# EAGLE design London_EPS-v.2.0 (EAGLE 9.4.2)
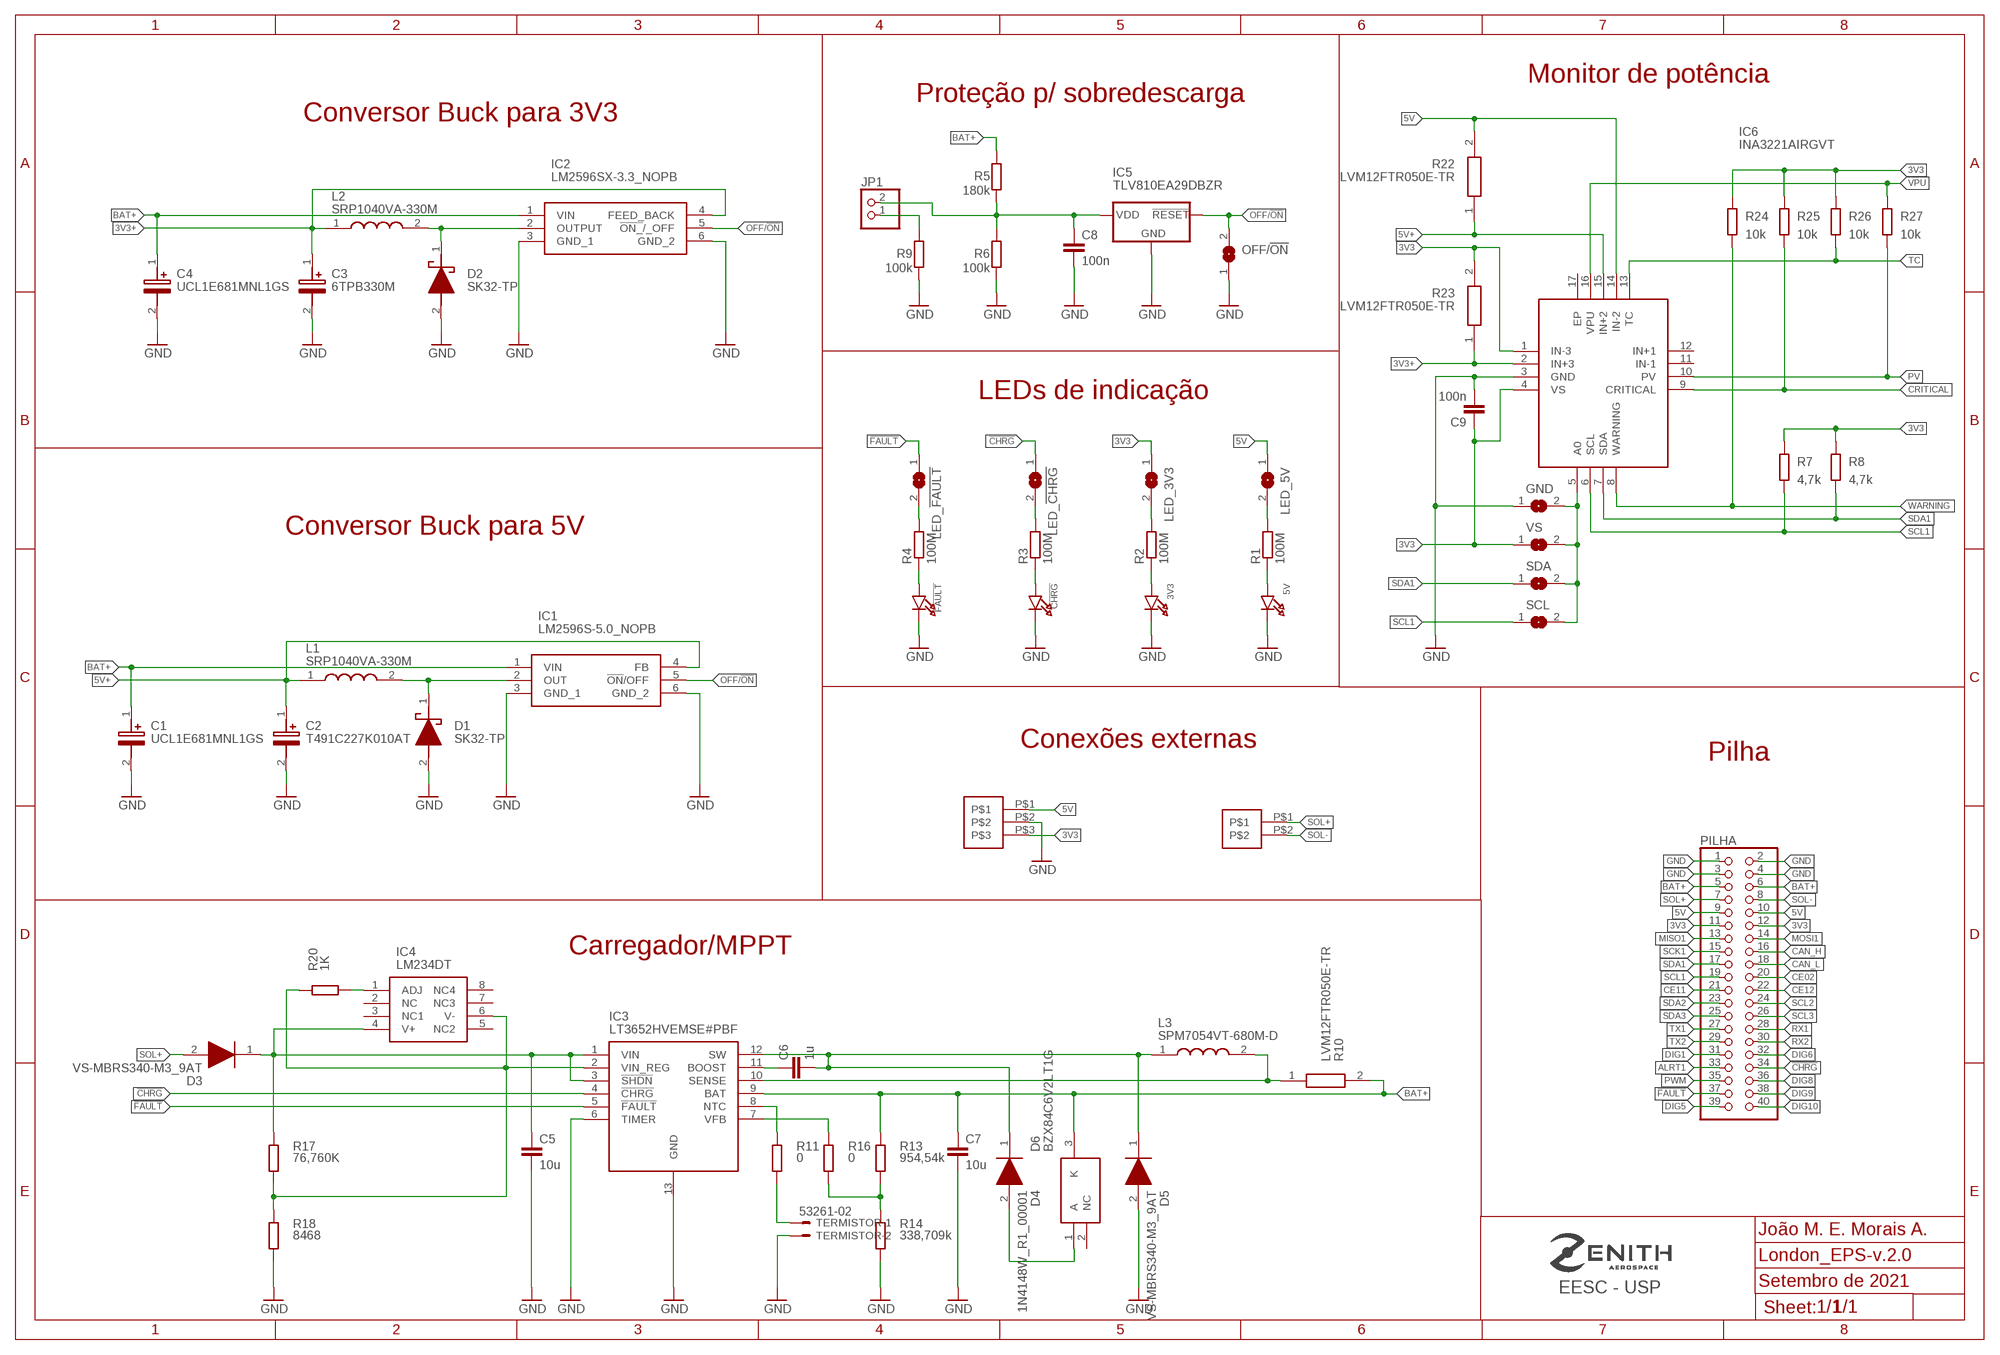
[diagram p0: schematic, sheet 1]

## Parts
3V3  LED1206  [CHIPLED_1206]
5V  LED1206  [CHIPLED_1206]
!CHRG  LED1206  [CHIPLED_1206]
!FAULT  LED1206  [CHIPLED_1206]
C1  UCL1E681MNL1GS  [CAPAE1030X1400N]
C2  T491C227K010AT  [CAPPM6032X280N]
C3  6TPB330M  [10TPF150ML]
C4  UCL1E681MNL1GS  [CAPAE1030X1400N]
C5  10u  C-EUC0805  [C0805]
C6  1u  C-EUC0805  [C0805]
C7  10u  C-EUC0805  [C0805]
C8  100n  C-EUC0805  [C0805]
C9  100n  C-EUC0805  [C0805]
D1  SK32-TP  [DIOM7959X262N@1]
D2  SK32-TP  [DIOM7959X262N@1]
D3  VS-MBRS340-M3_9AT  [DIOM7959X262N]
D4  1N4148W_R1_00001  [SOD3816X135N]
D5  VS-MBRS340-M3_9AT  [DIOM7959X262N]
D6  BZX84C6V2LT1G  [SOT96P237X111-3N]
GND  SOLDERJUMPERREFLOW_NOPASTE  [SOLDERJUMPER_REFLOW_NOPASTE]
IC1  LM2596S-5.0_NOPB  [KTT0005B]
IC2  LM2596SX-3.3_NOPB  [KTT0005B]
IC3  LT3652HVEMSE#PBF  [SOP65P490X110-13N]
IC4  LM234DT  [SOIC127P600X175-8N]
IC5  TLV810EA29DBZR  [SOT23]
IC6  INA3221AIRGVT  [QFN65P400X400X100-17N]
JP1  PINHD-1X2/90  [1X02/90]
L1  SRP1040VA-330M  [INDPM110100X400N]
L2  SRP1040VA-330M  [INDPM110100X400N]
L3  SPM7054VT-680M-D  [SPM7054VT]
LED_3V3  SOLDERJUMPERREFLOW_NOPASTE  [SOLDERJUMPER_REFLOW_NOPASTE]
LED_5V  SOLDERJUMPERREFLOW_NOPASTE  [SOLDERJUMPER_REFLOW_NOPASTE]
LED_!CHRG  SOLDERJUMPERREFLOW_NOPASTE  [SOLDERJUMPER_REFLOW_NOPASTE]
LED_!FAULT  SOLDERJUMPERREFLOW_NOPASTE  [SOLDERJUMPER_REFLOW_NOPASTE]
OFF/!ON  SOLDERJUMPERREFLOW_NOPASTE  [SOLDERJUMPER_REFLOW_NOPASTE]
PILHA  PINHD-2X20  [2X20]
R1  100M  R-EU_R0805  [R0805]
R2  100M  R-EU_R0805  [R0805]
R3  100M  R-EU_R0805  [R0805]
R4  100M  R-EU_R0805  [R0805]
R5  180k  R-EU_R0805  [R0805]
R6  100k  R-EU_R0805  [R0805]
R7  4,7k  R-EU_R0805  [R0805]
R8  4,7k  R-EU_R0805  [R0805]
R9  100k  R-EU_R0805  [R0805]
R10  LVM12FTR050E-TR  [RESC3016X70N]
R11  0  R-EU_R0805  [R0805]
R13  954,54k  R-EU_R0805  [R0805]
R14  338,709k  R-EU_R0805  [R0805]
R16  0  R-EU_R0805  [R0805]
R17  76,760K  R-EU_R0805  [R0805]
R18  8468  R-EU_R0805  [R0805]
R20  1K  R-EU_R0805  [R0805]
R22  LVM12FTR050E-TR  [RESC3016X70N]
R23  LVM12FTR050E-TR  [RESC3016X70N]
R24  10k  R-EU_R0805  [R0805]
R25  10k  R-EU_R0805  [R0805]
R26  10k  R-EU_R0805  [R0805]
R27  10k  R-EU_R0805  [R0805]
SCL  SOLDERJUMPERREFLOW_NOPASTE  [SOLDERJUMPER_REFLOW_NOPASTE]
SDA  SOLDERJUMPERREFLOW_NOPASTE  [SOLDERJUMPER_REFLOW_NOPASTE]
TERMISTOR  53261-02  [53261-02]
U$1  S02B-XASS-1  [S02B-XASS-1]
U$2  S03B-XASS-1  [S03B-XASS-1]
VS  SOLDERJUMPERREFLOW_NOPASTE  [SOLDERJUMPER_REFLOW_NOPASTE]

## Nets
3V3: C9.1 IC6.1(IN-3) IC6.4(VS) LED_3V3.1 PILHA.11 PILHA.12 R7.2 R8.2 R23.2 R24.2 R25.2 R26.2 U$2.P$3 VS.1
3V3+: C3.1(+) IC2.4(FEED_BACK) IC6.2(IN+3) L2.1 R23.1
5V: IC6.14(IN-2) LED_5V.1 PILHA.9 PILHA.10 R22.2 U$2.P$1
5V+: C2.1(+) IC1.4(FB) IC6.15(IN+2) L1.1 R22.1
!CHRG: IC3.4(!CHRG) LED_!CHRG.1 PILHA.34
!FAULT: IC3.5(!FAULT) LED_!FAULT.1 PILHA.37
ALRT1: PILHA.33
BAT+: C1.1(+) C4.1(+) C7.1 D6.3(K) IC1.1(VIN) IC2.1(VIN) IC3.9(BAT) PILHA.5 PILHA.6 R5.1 R10.2 R13.1
CAN_H: PILHA.16
CAN_L: PILHA.18
CE02: PILHA.20
CE11: PILHA.21
CE12: PILHA.22
CRITICAL: IC6.9(CRITICAL) R25.1
DIG1: PILHA.31
DIG5: PILHA.39
DIG6: PILHA.32
DIG8: PILHA.36
DIG9: PILHA.38
DIG10: PILHA.40
GND: 3V3.C 5V.C !CHRG.C !FAULT.C C1.2(-) C2.2(-) C3.2(-) C4.2(-) C5.2 C7.2 C8.2 C9.2 D1.2(A) D2.2(A) D5.2(A) GND.1 IC1.3(GND_1) IC1.6(GND_2) IC2.3(GND_1) IC2.6(GND_2) IC3.6(TIMER) IC3.13(GND) IC5.2(GND) IC6.3(GND) OFF/!ON.1 PILHA.1 PILHA.2 PILHA.3 PILHA.4 R6.2 R9.2 R14.2 R18.2 TERMISTOR.2 U$2.P$2
MISO1: PILHA.13
MOSI1: PILHA.14
N$1: 5V.A R1.1
N$2: LED_5V.2 R1.2
N$3: 3V3.A R2.1
N$4: LED_3V3.2 R2.2
N$5: !CHRG.A R3.1
N$6: D2.1(K) IC2.2(OUTPUT) L2.2
N$7: LED_!CHRG.2 R3.2
N$8: D1.1(K) IC1.2(OUT) L1.2
N$9: !FAULT.A R4.1
N$10: LED_!FAULT.2 R4.2
N$11: C8.1 IC5.3(VDD) JP1.2 R5.2 R6.1
N$12: GND.2 IC6.5(A0) SCL.2 SDA.2 VS.2
N$13: JP1.1 R9.1
N$20: IC3.10(SENSE) L3.2 R10.1
N$21: IC3.8(NTC) R11.1
N$22: R11.2 TERMISTOR.1
N$23: C6.2 D4.1(K) D5.1(K) IC3.12(SW) L3.1
N$24: IC3.7(VFB) R16.1
N$25: R13.2 R14.1 R16.2
N$26: C6.1 IC3.11(BOOST)
N$27: C5.1 D3.1(K) IC3.1(VIN) IC3.3(!SHDN) IC4.4(V+) R17.1
N$28: IC3.2(VIN_REG) IC4.6(V-) R17.2 R18.1 R20.1
N$29: IC4.1(ADJ) R20.2
N$30: D4.2(A) D6.1(A)
OFF/!ON: IC1.5(!ON!/OFF) IC2.5(!ON_!/_OFF) IC5.1(!RESET) OFF/!ON.2
PV: IC6.10(PV) R27.1
PWM: PILHA.35
RX1: PILHA.28
RX2: PILHA.30
SCK1: PILHA.15
SCL1: IC6.6(SCL) PILHA.19 R7.1 SCL.1
SCL2: PILHA.24
SCL3: PILHA.26
SDA1: IC6.7(SDA) PILHA.17 R8.1 SDA.1
SDA2: PILHA.23
SDA3: PILHA.25
SOL+: D3.2(A) PILHA.7 U$1.P$1
SOL-: PILHA.8 U$1.P$2
TC: IC6.13(TC) R26.1
TX1: PILHA.27
TX2: PILHA.29
VPU: IC6.16(VPU) R27.2
WARNING: IC6.8(WARNING) R24.1
Unconnected: D6.2(NC) IC4.2(NC) IC4.3(NC1) IC4.5(NC2) IC4.7(NC3) IC4.8(NC4) IC6.11(IN-1) IC6.12(IN+1) IC6.17(EP)

## Notes on the sheet
- Monitor de potência
- Proteção p/ sobredescarga
- Conversor Buck para 3V3
- LEDs de indicação
- Conversor Buck para 5V
- Conexões externas
- Pilha
- Carregador/MPPT
- João M. E. Morais A.
- EESC - USP | Setembro de 2021
- 1/1
- C:/Users/marcu/Desktop/Ensino Superior/Graduação - Eng Elétrica/Zenith/zenith-v2.bmp

## Library data of the parts
3V3 5V !CHRG !FAULT = microbuilder:LED: LED 0603 - 0603 Surface Mount Package 2mA: Green LED - Low Power (3.9mcd, 2ma, 1.7Vf) - Digikey: 475-2709-2-ND Orange LED - Low Power (9.8mcd, 2ma, 1.8Vf) - Digikey: 475-1194-2-ND Red LED - Low Power (5mcd, 2ma, 1.8Vf) - Digikey: 475-1195-2-ND Yellow LED - Low Power (7mcd, 2ma, 1.8Vf) - Digikey: 475-1196-2-ND 5mA: Blue LED - Low Power (17mcd, 5ma, 2.9Vf) - Digikey: LNJ937W8CRACT-ND 0805 - 0805 Surface Mount Package 2mA: Red LED (8.8mcd, 2mA, 1.8Vf, Clear) - Low Power [Digikey: 475-2510-1-ND] Green LED (5mcd, 2mA, 1.8Vf, Clear) - Low Power [Digikey: 475-2730-1-ND] Yellow LED (11.3mcd, 2mA, 1.8Vf, Clear) - Low Power [Digikey: 475-2555-1-ND] 20mA: Red LED (104mcd, 20mA, Diffused) - LS R976 [Digikey: 475-1278-6-ND] Red LED (12mcd, 20mA, 2.0Vf, Clear) - APT2012EC [Digikey: 754-1128-1-ND] Green LED (15mcd, 20mA, 2.2Vf, Clear) - APT2012GC [Digikey: 754-1131-1-ND] Orange LED (160mcd, 20mA, 2.1Vf, Clear) - APT2012SECK [Digikey: 754-1130-1-ND] 1206 - 1206 Surface Mount Package Green LED (26mcd, 20mA, Diffused) - LG N971 [Digikey: 475-1407-6-ND] Red LED (15mcd, 20mA, Diffused) - LH N974 [Digikey: 475-1416-6-ND]
C1 C4 = SamacSys_Parts:UCL1E681MNL1GS: NICHICON - UCL1E681MNL1GS - ALUMINUM ELECTROLYTIC CAPACITOR, 680UF, 25V, 20%, SMD Source: Datasheet <http://nichicon-us.com/english/products/pdfs/e-ucl.pdf>; DESCRIPTION: NICHICON - UCL1E681MNL1GS - ALUMINUM ELECTROLYTIC CAPACITOR, 680UF, 25V, 20%, SMD; HEIGHT: 14mm; MANUFACTURER_NAME: Nichicon; MANUFACTURER_PART_NUMBER: UCL1E681MNL1GS; MOUSER_PART_NUMBER: 647-UCL1E681MNL1GS; MOUSER_PRICE-STOCK: https://www.mouser.co.uk/ProductDetail/Nichicon/UCL1E681MNL1GS?qs=eL6fcoQH66M8vW0uh%252B9gAg%3D%3D
C2 = SamacSys_Parts:T491C227K010AT: KEMET - T491C227K010AT - CAP, 220F, 10V, 10% Source: Datasheet <https://api.kemet.com/component-edge/download/datasheet/T491C227K010AT.pdf>; DESCRIPTION: KEMET - T491C227K010AT - CAP, 220F, 10V, 10%; HEIGHT: 2.8mm; MANUFACTURER_NAME: Kemet; MANUFACTURER_PART_NUMBER: T491C227K010AT; MOUSER_PART_NUMBER: 80-T491C227K010AT; MOUSER_PRICE-STOCK: https://www.mouser.co.uk/ProductDetail/KEMET/T491C227K010AT?qs=wo4x%252BUeoG8X8nx3rGRELKA%3D%3D
C3 = SamacSys_Parts:6TPB330M: Panasonic 330uF 6.3V dc Tantalum Capacitor Polymer Solid +/-20% Tolerance POSCAP TPB Series Source: Datasheet <https://componentsearchengine.com/Datasheets/1/6TPB330M.pdf>; DESCRIPTION: Panasonic 330uF 6.3V dc Tantalum Capacitor Polymer Solid +/-20% Tolerance POSCAP TPB Series; HEIGHT: 3mm; MANUFACTURER_NAME: Panasonic; MANUFACTURER_PART_NUMBER: 6TPB330M; MOUSER_PART_NUMBER: 667-6TPB330M; MOUSER_PRICE-STOCK: https://www.mouser.com/Search/Refine.aspx?Keyword=667-6TPB330M
C5-C9 = rcl:C-EU: CAPACITOR, European symbol; SPICEPREFIX: C
D1 D2 = SamacSys_Parts:SK32-TP: Schottky Diodes & Rectifiers 20V 3A Source: Datasheet; DESCRIPTION: Schottky Diodes & Rectifiers 20V 3A; HEIGHT: 2.62mm; MANUFACTURER_NAME: Micro Commercial Components (MCC); MANUFACTURER_PART_NUMBER: SK32-TP; MOUSER_PART_NUMBER: 833-SK32-TP; MOUSER_PRICE-STOCK: https://www.mouser.co.uk/ProductDetail/Micro-Commercial-Components-MCC/SK32-TP?qs=5RZ97ty5sIboMkWgJFJZfw%3D%3D
D3 D5 = SamacSys_Parts:VS-MBRS340-M3_9AT: Schottky Diodes & Rectifiers 3A 40V Single Die Schottky Rectifier Source: Datasheet <https://componentsearchengine.com/Datasheets/1/VS-MBRS340-M3_9AT.pdf>; DESCRIPTION: Schottky Diodes & Rectifiers 3A 40V Single Die Schottky Rectifier; HEIGHT: 2.62mm; MANUFACTURER_NAME: Vishay; MANUFACTURER_PART_NUMBER: VS-MBRS340-M3/9AT; MOUSER_PART_NUMBER: 78-VS-MBRS340-M39AT; MOUSER_PRICE-STOCK: https://www.mouser.co.uk/ProductDetail/Vishay-Semiconductors/VS-MBRS340-M3-9AT?qs=nc3S1USEIbv1XISTKnRMKw%3D%3D
D4 = SamacSys_Parts:1N4148W_R1_00001: Diodes - General Purpose, Power, Switching /A2/TR/7"/HF/3K/SOD-123/SWI/SOD/USM-04/USM04-QI01/PJ/// Source: Datasheet; DESCRIPTION: Diodes - General Purpose, Power, Switching /A2/TR/7"/HF/3K/SOD-123/SWI/SOD/USM-04/USM04-QI01/PJ///; HEIGHT: 1.35mm; MANUFACTURER_NAME: PANJIT; MANUFACTURER_PART_NUMBER: 1N4148W_R1_00001; MOUSER_PART_NUMBER: 241-1N4148W_R1_00001; MOUSER_PRICE-STOCK: https://www.mouser.co.uk/ProductDetail/Panjit/1N4148W_R1_00001?qs=sPbYRqrBIVnqVztCqPNVrw%3D%3D
D6 = SamacSys_Parts:BZX84C6V2LT1G: 250 mW, 6.2 V +/-5% ZenerDiodeVoltage Regulator Source: Datasheet <http://www.onsemi.com/pub/Collateral/BZX84C2V4LT1-D.PDF>; DESCRIPTION: 250 mW, 6.2 V +/-5% ZenerDiodeVoltage Regulator; HEIGHT: 1.11mm; MANUFACTURER_NAME: ON Semiconductor; MANUFACTURER_PART_NUMBER: BZX84C6V2LT1G; MOUSER_PART_NUMBER: 863-BZX84C6V2LT1G; MOUSER_PRICE-STOCK: https://www.mouser.co.uk/ProductDetail/ON-Semiconductor/BZX84C6V2LT1G?qs=vNc2DXHODiLlYtM0EF5Eqg%3D%3D
GND LED_3V3 LED_5V LED_!CHRG LED_!FAULT OFF/!ON SCL SDA VS = microbuilder:SOLDERJUMPER: SMD Solder JUMPER Solder the two pads together to create a connection, or remove the solder to break it. REFLOW - Use this footprint for solder paste and reflow ovens. WAVE - Use this footprint for hand-soldering (larger pads). CLOSED - Has a trace between the two pads to ensure it is closed by default. The trace needs to be cut to disable the jumper, and can be closed again by creating a solder bridge between the two pads.
IC1 = SamacSys_Parts:LM2596S-5.0_NOPB: Switching Voltage Regulators 150 KHZ 3A STEP-DOWN VLTG REG Source: Datasheet <https://www.ti.com/lit/gpn/LM2596>; DESCRIPTION: Switching Voltage Regulators 150 KHZ 3A STEP-DOWN VLTG REG; HEIGHT: mm; MANUFACTURER_NAME: Texas Instruments; MANUFACTURER_PART_NUMBER: LM2596S-5.0/NOPB; MOUSER_PART_NUMBER: 926-LM2596S-5.0/NOPB; MOUSER_PRICE-STOCK: https://www.mouser.co.uk/ProductDetail/Texas-Instruments/LM2596S-50-NOPB?qs=X1J7HmVL2ZHVjCOmW%252BYINA%3D%3D
IC2 = SamacSys_Parts:LM2596SX-3.3_NOPB: SIMPLE SWITCHER 4.5V to 40V, 3A Low Component Count Step-Down Regulator Source: Datasheet <http://www.ti.com/lit/gpn/lm2596>; DESCRIPTION: SIMPLE SWITCHER 4.5V to 40V, 3A Low Component Count Step-Down Regulator; HEIGHT: mm; MANUFACTURER_NAME: Texas Instruments; MANUFACTURER_PART_NUMBER: LM2596SX-3.3/NOPB; MOUSER_PART_NUMBER: 926-LM2596SX33NOPB; MOUSER_PRICE-STOCK: https://www.mouser.co.uk/ProductDetail/Texas-Instruments/LM2596SX-33-NOPB?qs=X1J7HmVL2ZEm4UYTFC0WWA%3D%3D
IC3 = SamacSys_Parts:LT3652HVEMSE#PBF: Power Tracking 2A Battery Charger Linear Technology LT3652HVEMSE#PBF, Battery Charger Lithium-Ion, Lithium-Polymer, 12-Pin MSOP Source: Datasheet <https://componentsearchengine.com/Datasheets/2/LT3652HVEMSE#PBF.pdf>; DESCRIPTION: Power Tracking 2A Battery Charger Linear Technology LT3652HVEMSE#PBF, Battery Charger Lithium-Ion, Lithium-Polymer, 12-Pin MSOP; HEIGHT: 1.1mm; MANUFACTURER_NAME: Linear Technology; MANUFACTURER_PART_NUMBER: LT3652HVEMSE#PBF; MOUSER_PART_NUMBER: 584-LT3652HVEMSE#PBF; MOUSER_PRICE-STOCK: https://www.mouser.co.uk/ProductDetail/Analog-Devices-Linear-Technology/LT3652HVEMSEPBF?qs=hVkxg5c3xu%252Bv4Rj40QGufg%3D%3D
IC4 = SamacSys_Parts:LM234DT: LM234DT, Voltage Reference 8-Pin SO Source: Datasheet; DESCRIPTION: LM234DT, Voltage Reference 8-Pin SO; HEIGHT: 1.75mm; MANUFACTURER_NAME: STMicroelectronics; MANUFACTURER_PART_NUMBER: LM234DT; MOUSER_PART_NUMBER: 511-LM234D; MOUSER_PRICE-STOCK: https://www.mouser.co.uk/ProductDetail/STMicroelectronics/LM234DT?qs=RnzODY3cU8u4ZnW3y3uo%252Bg%3D%3D
IC5 = tlv:TLV810EA29DBZR
IC6 = SamacSys_Parts:INA3221AIRGVT: 26-V, Triple, Bi-Directional, Zero-Drift, Low-/High-Side, I2C Out Current/Voltage Monitor w/ Alerts Source: Datasheet <http://www.ti.com/lit/gpn/ina3221>; DESCRIPTION: 26-V, Triple, Bi-Directional, Zero-Drift, Low-/High-Side, I2C Out Current/Voltage Monitor w/ Alerts; HEIGHT: 1mm; MANUFACTURER_NAME: Texas Instruments; MANUFACTURER_PART_NUMBER: INA3221AIRGVT; MOUSER_PART_NUMBER: 595-INA3221AIRGVT; MOUSER_PRICE-STOCK: https://www.mouser.co.uk/ProductDetail/Texas-Instruments/INA3221AIRGVT?qs=3AcK5DacLboWEe6h2c2gyA%3D%3D
JP1 = pinhead:PINHD-1X2: PIN HEADER
L1 L2 = SamacSys_Parts:SRP1040VA-330M: Fixed Inductors Ind,11x10x3.8mm,33uH20%,5A,Shd,SMD Source: Datasheet <https://componentsearchengine.com/Datasheets/2/SRP1040VA-330M.pdf>; DESCRIPTION: Fixed Inductors Ind,11x10x3.8mm,33uH20%,5A,Shd,SMD; HEIGHT: 4mm; MANUFACTURER_NAME: Bourns; MANUFACTURER_PART_NUMBER: SRP1040VA-330M; MOUSER_PART_NUMBER: 652-SRP1040VA-330M; MOUSER_PRICE-STOCK: https://www.mouser.co.uk/ProductDetail/Bourns/SRP1040VA-330M?qs=OlC7AqGiEDkSy1ah9ytHCQ%3D%3D
L3 = SamacSys_Parts:SPM7054VT-680M-D: Inductors for power circuits, Wound metal, Automotive Source: Datasheet <https://product.tdk.com/system/files/dam/doc/product/inductor/inductor/smd/catalog/inductor_automotive_power_spm7054vt-d_en.pdf>; DESCRIPTION: Inductors for power circuits, Wound metal, Automotive; HEIGHT: mm; MANUFACTURER_NAME: TDK; MANUFACTURER_PART_NUMBER: SPM7054VT-680M-D; MOUSER_PART_NUMBER: 810-SPM7054VT-680M-D; MOUSER_PRICE-STOCK: https://www.mouser.co.uk/ProductDetail/TDK/SPM7054VT-680M-D?qs=BJlw7L4Cy7%2F5GJUhXb8MnA%3D%3D
PILHA = pinhead:PINHD-2X20: PIN HEADER
R1-R9 R11 R13 R14 R16-R18 R20 R24-R27 = rcl:R-EU_: RESISTOR, European symbol; SPICEPREFIX: R
R10 R22 R23 = SamacSys_Parts:LVM12FTR050E-TR: Current Sense Resistors - SMD 0.5W 0.050 Ohm 1% Source: Datasheet <https://componentsearchengine.com/Datasheets/1/LVM12FTR050E-TR.pdf>; DESCRIPTION: Current Sense Resistors - SMD 0.5W 0.050 Ohm 1%; HEIGHT: 0.7mm; MANUFACTURER_NAME: Ohmite; MANUFACTURER_PART_NUMBER: LVM12FTR050E-TR; MOUSER_PART_NUMBER: 588-LVM12FTR050E-TR; MOUSER_PRICE-STOCK: https://www.mouser.co.uk/ProductDetail/Ohmite/LVM12FTR050E-TR?qs=sE1HjTVAc2ibWupmexfpPA%3D%3D
TERMISTOR = con-molex:53?-02: CONNECTOR wire to board 1.25 mm (.049 inch) pitch header; MF: MOLEX; OC_FARNELL: 1125373; OC_NEWARK: unknown
U$1 = JST-XA:S02B-XASS-1
U$2 = JST-XA:S03B-XASS-1

## Board
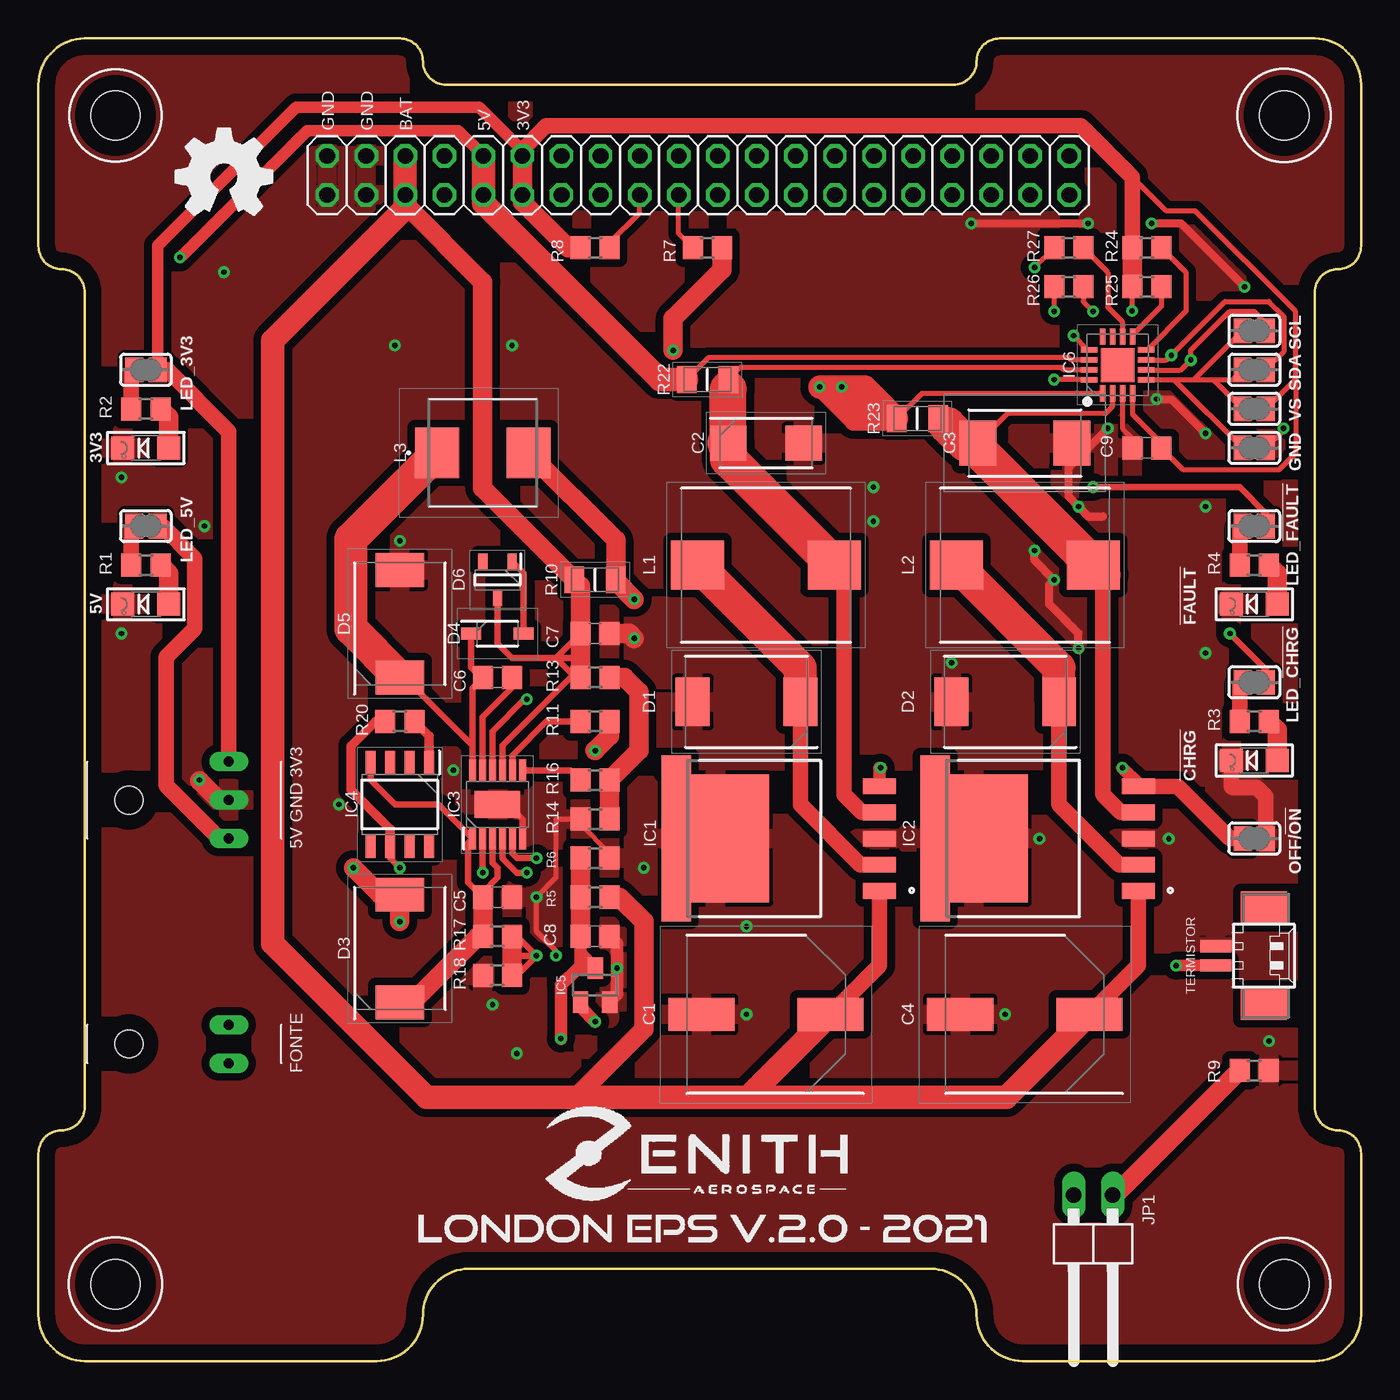
[diagram p1: board, top side]
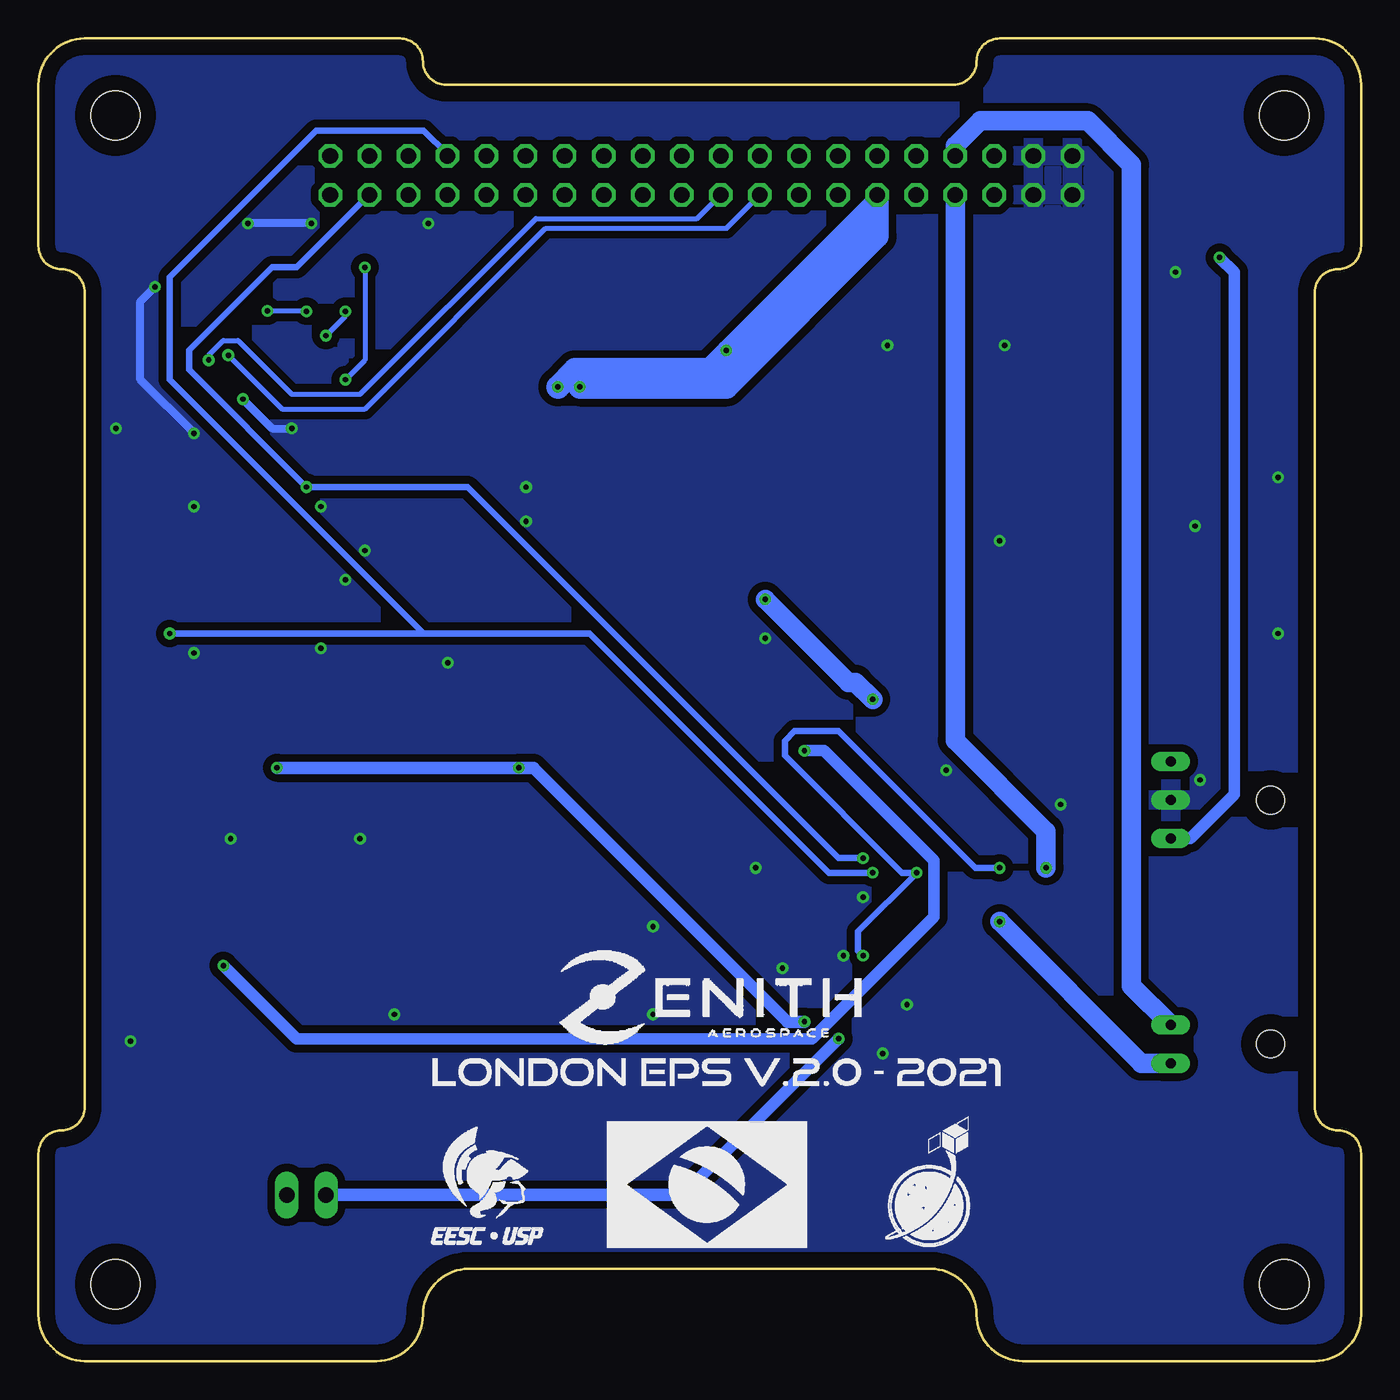
[diagram p2: board, bottom side, seen from below]

Size 86 x 86 mm. Coordinates in mm from the lower left corner, seen from the top.
Outline: 0,83 0,72.5 arc90 1.5,71 arc-90 3,69.5 3,16.5 arc-90 1.5,15 arc90 0,13.5 0,3 arc90 3,0 22,0 arc90 25,3 arc-90 28,6 58,6 arc-90 61,3 arc90 64,0 83,0 arc90 86,3 86,13.5 arc90 84.5,15 arc-90 83,16.5 83,69.5 arc-90 84.5,71 arc90 86,72.5 86,83 arc90 83,86 62.5,86 arc90 61,84.5 arc-90 59.5,83 26.5,83 arc-90 25,84.5 arc90 23.5,86 3,86 arc90 0,83
Copper layers (1*16): Top 0.035mm / dielectric 1.5mm / Bottom 0.035mm
Design rules "default *": minimum track width 6mil, minimum drill 0.35mm, track to track 6mil, track to pad 6mil, pad to pad 6mil, via to via 6mil, smd to smd 6mil, copper to edge 40mil, drill to drill 6mil, minimum pad ring 10mil, minimum via ring 8mil, stop-mask expansion 4mil, vias tented up to drill 30mil, thermal gap 10mil
Holes 3.2 mm at 5,5 81,5 81,81 5,81

### Footprints (pad centres in the part's own frame; a part is rotated, then mirrored left to right if it is on the bottom)
CHIPLED_1206 = smd 1.5 x 1.5: A 0,-1.496; C 0,1.496
CAPAE1030X1400N = smd 4.3 x 2.15: 1 -4.2,0; 2 4.2,0
CAPPM6032X280N = smd 2.35 x 2.25: 1 -2.45,0; 2 2.45,0
10TPF150ML = smd 2.4 x 2.9: 1 -3.05,0; 2 3.05,0
C0805 = smd 1.3 x 1.5: 1 -0.95,0; 2 0.95,0
DIOM7959X262N@1 = smd 2.2 x 3.15: 1 -3.5,0; 2 3.5,0
DIOM7959X262N = smd 2.2 x 3.15: 1 -3.5,0; 2 3.5,0
SOD3816X135N = smd 1.3 x 0.8: 1 -1.7,0; 2 1.7,0
SOT96P237X111-3N = smd 1 x 0.6: 1 -1.2,0.955; 2 -1.2,-0.955; 3 1.2,0
SOLDERJUMPER_REFLOW_NOPASTE = smd 1.168 x 1.6: 1 -0.762,0; 2 0.762,0
KTT0005B = smd 2.16 x 1.02: 1 12.461,-3.4; 2 12.461,-1.7; 3 12.461,0; 4 12.461,1.7; 5 12.461,3.4 | smd 6.99 x 8.33: 6 1.786,0 | smd 1.91 x 1.235: 7 -0.754,4.782; 8 -0.754,-4.782
SOP65P490X110-13N = smd 1.425 x 0.45: 1 -2.212,1.625; 2 -2.212,0.975; 3 -2.212,0.325; 4 -2.212,-0.325; 5 -2.212,-0.975; 6 -2.212,-1.625; 7 2.212,-1.625; 8 2.212,-0.975; 9 2.212,-0.325; 10 2.212,0.325; 11 2.212,0.975; 12 2.212,1.625 | smd 1.753 x 2.947: 13 0,0
SOIC127P600X175-8N = smd 1.525 x 0.65: 1 -2.712,1.905; 2 -2.712,0.635; 3 -2.712,-0.635; 4 -2.712,-1.905; 5 2.712,-1.905; 6 2.712,-0.635; 7 2.712,0.635; 8 2.712,1.905
SOT23 = smd 1 x 1.4: 1 -0.95,-1.1; 2 0.95,-1.1; 3 0,1.1
QFN65P400X400X100-17N = smd 1.05 x 0.35: 1 -1.85,0.975; 2 -1.85,0.325; 3 -1.85,-0.325; 4 -1.85,-0.975; 9 1.85,-0.975; 10 1.85,-0.325; 11 1.85,0.325; 12 1.85,0.975 | smd 0.35 x 1.05: 5 -0.975,-1.85; 6 -0.325,-1.85; 7 0.325,-1.85; 8 0.975,-1.85; 13 0.975,1.85; 14 0.325,1.85; 15 -0.325,1.85; 16 -0.975,1.85 | smd 2.2 x 2.2: 17 0,0
1X02/90 = drill 1.016 long: 1 -1.27,-3.81; 2 1.27,-3.81
INDPM110100X400N = smd 3.45 x 3.2: 1 -4.45,0; 2 4.45,0
SPM7054VT = smd 2.85 x 3.3: 1 -2.975,0; 2 2.975,0
2X20 = drill 1.016 octagon: 1 -24.13,-1.27; 2 -24.13,1.27; 3 -21.59,-1.27; 4 -21.59,1.27; 5 -19.05,-1.27; 6 -19.05,1.27; 7 -16.51,-1.27; 8 -16.51,1.27; 9 -13.97,-1.27; 10 -13.97,1.27; 11 -11.43,-1.27; 12 -11.43,1.27; 13 -8.89,-1.27; 14 -8.89,1.27; 15 -6.35,-1.27; 16 -6.35,1.27; 17 -3.81,-1.27; 18 -3.81,1.27; 19 -1.27,-1.27; 20 -1.27,1.27; 21 1.27,-1.27; 22 1.27,1.27; 23 3.81,-1.27; 24 3.81,1.27; 25 6.35,-1.27; 26 6.35,1.27; 27 8.89,-1.27; 28 8.89,1.27; 29 11.43,-1.27; 30 11.43,1.27; 31 13.97,-1.27; 32 13.97,1.27; 33 16.51,-1.27; 34 16.51,1.27; 35 19.05,-1.27; 36 19.05,1.27; 37 21.59,-1.27; 38 21.59,1.27; 39 24.13,-1.27; 40 24.13,1.27
R0805 = smd 1.3 x 1.5: 1 -0.95,0; 2 0.95,0
RESC3016X70N = smd 1.25 x 1.75: 1 -1.35,0; 2 1.35,0
53261-02 = smd 0.8 x 2: 1 0.625,-2.5; 2 -0.625,-2.5 | smd 2.1 x 3: S1 3.125,0.625; S2 -3.125,0.625
S02B-XASS-1 = drill 0.65 pad 1.27 long: P$1 0,0; P$2 2.5,0 | hole 1.8: 1.25,6.5
S03B-XASS-1 = drill 0.65 pad 1.27 long: P$1 0,0; P$2 2.5,0; P$3 5,0 | hole 1.8: 2.5,6.5

### Placement (x,y rotation side)
3V3  6.99,59.37 90 top
5V  6.99,49.21 90 top
!CHRG  79.06,39.05 90 top
!FAULT  79.06,49.21 90 top
C1  47.31,22.54 180 top
C2  47.31,59.69 0 top
C3  64.14,59.69 0 top
C4  64.14,22.54 180 top
C5  29.84,30.16 0 top
C6  29.84,44.45 180 top
C7  36.2,47.31 0 top
C8  36.2,27.62 0 top
C9  72.07,59.37 180 top
D1  46.04,42.86 180 top
D2  62.87,42.86 180 top
D3  23.5,26.83 90 top
D4  29.84,47.31 0 top
D5  23.5,47.94 90 top
D6  29.84,50.8 270 top
GND  79.06,59.37 180 top
IC1  42.23,33.97 0 top
IC2  59.05,33.97 0 top
IC3  29.84,36.2 90 top
IC4  23.5,36.2 270 top
IC5  36.2,24.45 0 top
IC6  70.17,64.77 90 top
JP1  68.58,6.99 180 top
L1  47.31,51.75 180 top
L2  64.14,51.75 180 top
L3  28.89,59.05 0 top
LED_3V3  6.99,64.45 180 top
LED_5V  6.99,54.29 180 top
LED_!CHRG  79.06,44.13 180 top
LED_!FAULT  79.06,54.29 180 top
OFF/!ON  79.06,33.97 180 top
PILHA  42.9,77.1 0 top
R1  6.99,51.75 180 top
R2  6.99,61.91 180 top
R3  79.06,41.59 180 top
R4  79.06,51.75 180 top
R5  36.2,30.16 180 top
R6  36.2,32.7 0 top
R7  43.5,72.39 0 top
R8  36.2,72.39 180 top
R9  79.06,18.89 0 top
R10  36.2,50.8 180 top
R11  36.2,41.59 0 top
R13  36.2,44.45 0 top
R14  36.2,35.24 180 top
R16  36.2,37.78 0 top
R17  29.84,27.62 0 top
R18  29.84,25.08 180 top
R20  23.5,41.59 0 top
R22  43.5,63.82 180 top
R23  57.15,61.28 180 top
R24  72.07,72.39 180 top
R25  72.07,69.85 180 top
R26  66.99,69.85 0 top
R27  66.99,72.39 180 top
SCL  79.06,66.99 180 top
SDA  79.06,64.45 180 top
TERMISTOR  79.06,26.35 270 top
U$1  12.38,19.37 90 top
U$2  12.38,33.97 90 top
VS  79.06,61.91 180 top

### Tracks (layer width: path | path; a pad name or v marks a point on that pad's centre or on a via)
3V3  (via drill 0.35)
  Top 0.33: R26.2 67.94,68.9 v68.58,68.26 | v71.1,68.28 71.12,68.3 R25.2 | IC6.4 71.14,61.57 73.02,59.69 C9.1 74.45,57.94 80.64,57.94 81.74,59.04 81.74,63.84 | VS.1 81.74,63.84 | 81.74,63.84 81.74,68.26 75.23,74.77 73.34,74.77 67.79,80.33 | 71.12,72.71 R24.2 | 55.88,61.28 R23.2 57.44,62.92 IC6.1
  Top 0.762: LED_3V3.1 7.75,72.52 16.76,81.53 28.65,81.53 31.47,78.7
  Top 1.016: LED_3V3.1 8.38,64.45 12.38,60.45 U$2.P$3 | R24.2 71.12,76.99 67.79,80.33 33.02,80.33 31.47,78.78 PILHA.12 31.47,78.7
  Top 1.27: 31.43,75.79 PILHA.11 | PILHA.11 PILHA.12 | R24.2 R25.2 | PILHA.11 31.47,75.35 34.43,72.39 R8.2 | v50.8,63.34 53.02,61.12 54.93,61.12 | v41.27,65.72 41.27,67.79 44.45,70.96 R7.2
  Top 1.524: R23.2 53.74,63.34 v50.8,63.34 v52.23,63.34 52.39,63.34 54.45,61.28 R23.2
  Bottom 0.33: v71.1,68.28 71.09,68.26 v68.58,68.26
  Bottom 1.27: 42.86,64.45 42.55,64.45 v41.27,65.72 31.47,75.53 PILHA.11
  Bottom 1.524: v50.8,63.34 41.26,63.34 31.47,73.13 PILHA.11 31.47,75.21 42.23,64.45 42.86,64.45 51.12,64.45 v52.23,63.34
3V3+
  Top 0.33: IC6.2 69.84,62.06 69.37,61.59 62.99,61.59 C3.1
  Top 1.016: IC2.4 70.37,35.67 69.22,36.83 69.22,51.12 L2.1 68.45,51.88
  Top 1.27: 61.09,59.33 61.09,59.25 | 59.09,60.84 58.94,60.84 R23.1
  Top 2.286: 68.45,51.88 69.22,51.12
  Top 2.413: L2.1 61.09,59.25 C3.1 60.25,59.69 59.09,60.84
5V  (via drill 0.35)
  Top 0.33: IC6.14 67.14,65.09 66.99,65.25 43.58,65.25 R22.2
  Top 0.762: PILHA.10 27.29,80.01 17.46,80.01 v9.21,71.75
  Top 1.016: LED_5V.1 8.06,54.29 10.16,52.2 10.16,47.62 8.31,45.77 8.31,37.41 11.75,33.97 U$2.P$1
  Top 1.524: PILHA.10 PILHA.9 28.93,75.29 40.4,63.82 R22.2
  Bottom 0.762: U$2.P$1 11.11,33.97 8.26,36.83 8.26,70.8 v9.21,71.75
5V+
  Top 0.33: IC6.15 66.68,64.44 66.52,64.61 45.64,64.61 R22.1
  Top 1.016: L1.1 52.39,51.12 52.39,36.83 53.55,35.67 IC1.4
  Top 1.27: 44.86,59.36 44.86,58.65 | 44.85,63.18 R22.1
  Top 2.413: L1.1 44.86,58.65 C2.1 | C2.1 44.69,59.69 | C2.1 44.85,59.7 44.85,63.18
!CHRG  (via drill 0.35)
  Top 0.432: IC3.4 30.17,32.7 31.11,31.75 v31.75,31.75 | 79.69,44.64 79.82,44.51 LED_!CHRG.1 79.82,44.96 v77.47,47.31
  Bottom 0.432: PILHA.34 59.41,78.46 60.96,80.01 67.94,80.01 77.47,70.48 77.47,63.82 60.96,47.31 | v31.75,31.75 34.61,31.75 50.16,47.31 60.96,47.31 | 60.96,47.31 v77.47,47.31
!FAULT  (via drill 0.35)
  Top 0.432: IC3.5 30.82,33 31.11,32.7 v32.38,32.7 | LED_!FAULT.1 79.82,55.12 78.11,56.83 v68.58,56.83
  Bottom 0.432: PILHA.37 64.5,75.83 69.22,71.12 70.8,71.12 76.2,65.72 76.2,64.45 v68.58,56.83 58.1,56.83 33.97,32.7 v32.38,32.7
BAT+
  Top 0.432: IC3.9 30.17,40.01 34.61,44.45 R13.1 | R13.1 35.24,45.72 | 35.24,45.72 C7.1 33.66,45.72 | D6.3 29.84,46.67 30.8,45.72 33.66,45.72 | R13.1 34.93,44.45 33.66,45.72 | 33.66,45.72 35.24,45.72
  Top 1.016: IC2.1 71.52,25.72 C4.1 | C1.1 54.69,25.72 IC1.1
  Top 1.27: R13.1 C7.1 35.24,50.4 R10.2 28.89,56.75 28.89,70.17 23.85,75.21 PILHA.5 | R5.1 37.78,30.16 39.37,28.57 39.37,21.59 34.92,17.14
  Top 1.524: PILHA.6 PILHA.5 23.85,74.97 15.24,66.36 15.24,27.15 25.24,17.14 34.92,17.14 46.11,17.14 | C1.1 46.11,17.14 | 46.11,17.14 62.94,17.14 C4.1
CRITICAL
  Top 0.33: R25.1 73.02,68.58 71.14,66.7 IC6.9
GND  (via drill 0.35)
  Top 0.305: R6.2 37.15,33.02 35.24,34.92 R14.2
  Top 0.33: IC6.3 70.49,60.63 71.12,60.01 C9.2 | v80.96,60.64 80.96,60.52 GND.1 | v33.66,26.35 33.66,26.67 32.38,27.94 v32.38,30.16 33.66,31.43 33.66,35.24 R14.2
  Top 0.432: IC3.6 31.47,35.2 30.48,36.2 IC3.13
  Top 0.508: v60.64,73.98 v68.26,73.98 | v72.39,73.98 74.3,73.98 v78.42,69.85 | 69.22,54.93 68.26,54.93 v67.63,55.56 66.99,56.2 66.99,58.1 v69.53,60.64 | v64.77,52.7 64.77,52.07 v66.04,50.8 65.72,50.48 65.72,49.21 67.63,47.31 v67.63,46.35 | v72.71,62.55 73.66,62.55 v75.88,60.33
  Top 0.762: U$2.P$2 11.71,36.47
  Top 0.813: IC5.2 37.62,23.83 v37.62,25.56 37.62,27.14 C8.2
  Top 1.016: OFF/!ON.1 79.82,36.7 79.22,37.31 77.63,37.31 77.56,37.37 !CHRG.C
  Top 1.143: 10.48,37.7 v10.48,37.78
  Top 1.27: 11.71,36.47 10.48,37.7 | v38.73,46.99 38.42,47.31 C7.2
  Top 2.159: 60.63,33.66 61.59,32.7 62.23,33.34 61.59,33.97 IC2.6
  Bottom 0.508: v68.26,73.98 v72.39,73.98 | v72.71,62.55 70.8,60.64 v69.53,60.64 | v75.88,60.33 79.38,63.82 79.38,68.9 v78.42,69.85
  other vias: 73.5,33.97 46.04,28.26 29.53,23.18 23.5,53.34 12.06,70.8 39.37,32.07 5.4,47.31 5.4,57.47 26.99,38.42 19.53,36.2 54.29,54.61 54.29,56.83 10.79,54.29 23.18,66.04 30.8,66.04 75.88,55.56 75.88,46.04 65.09,33.97 46.04,22.54 62.87,22.54 31.11,20 59.37,45.4 80.01,20.8
  pour Top (isolate 0.508): 64,0 83,0 arc90 86,3 86,13.5 arc90 84.5,15 arc-90 83,16.5 83,69.5 arc-90 84.5,71 arc90 86,72.5 86,83 arc90 83,86 62.5,86 arc90 61,84.5 arc-90 59.5,83 26.5,83 arc-90 25,84.5 arc90 23.5,86 3,86 arc90 0,83 0,72.5 arc90 1.5,71 arc-90 3,69.5 3,16.5 arc-90 1.5,15 arc90 0,13.5 0,3 arc90 3,0 22,0 arc90 25,3 arc-90 28,6 58,6 arc-90 61,3 arc90
  pour Bottom (isolate 0.508): 64,0 83,0 arc90 86,3 86,13.5 arc90 84.5,15 arc-90 83,16.5 83,69.5 arc-90 84.5,71 arc90 86,72.5 86,83 arc90 83,86 62.5,86 arc90 61,84.5 arc-90 59.5,83 26.5,83 arc-90 25,84.5 arc90 23.5,86 3,86 arc90 0,83 0,72.5 arc90 3.09,69.41 3.09,16.27 arc90 0,13.18 0,3 arc90 3,0 22,0 arc90 25,3 arc-90 28,6 58,6 arc-90 61,3 arc90
N$1
  Top 1.27: 5V.A 8.48,51.21 R1.1
N$2
  Top 1.016: LED_5V.2 6.04,54.1 R1.2
N$3
  Top 1.27: 3V3.A 8.48,61.37 R2.1
N$4
  Top 1.016: LED_3V3.2 6.04,64.26 R2.2
N$5
  Top 1.27: R3.1 80.55,41.05 !CHRG.A
N$6
  Top 1.016: IC2.2 70.28,32.27 66.36,36.19 D2.1
  Top 2.159: D2.1 66.36,45.07 L2.2
N$7
  Top 1.016: LED_!CHRG.2 78.11,43.94 R3.2
N$8
  Top 1.016: D1.1 49.54,36.19 53.45,32.27 IC1.2
  Top 2.159: D1.1 49.54,45.07 L1.2
N$9
  Top 1.27: R4.1 80.55,51.21 !FAULT.A
N$10
  Top 1.016: LED_!FAULT.2 78.11,54.1 R4.2
N$11  (via drill 0.35)
  Top 0.813: 35.24,26.5 IC5.3 35.07,25.55 | C8.1 35.24,26.5 | 35.24,26.5 35.24,25.72 35.07,25.55 | 35.07,25.55 33.97,24.45 v33.97,20.95
  Top 1.27: R6.1 R5.2 C8.1
  Bottom 0.813: v33.97,20.95 44.13,10.79 JP1.2
N$12
  Top 0.33: SDA.2 77.64,63.8 76.41,63.8 | 73.87,63.8 IC6.5 | VS.2 76.41,63.8 | 76.41,63.8 75.1,63.8 | SCL.2 75.1,63.8 | 75.1,63.8 73.87,63.8 | GND.2 73.87,63.8
N$13
  Top 1.27: R9.1 70.01,10.79 JP1.1
N$20  (via drill 0.35)
  Top 0.432: IC3.10 29.52,40.95 31.59,43.02 v31.75,43.02
  Top 1.27: L3.2 37.55,53.38 R10.1 37.55,50.72 v38.73,49.53
  Bottom 1.27: v38.73,49.53 33.34,44.13 32.86,44.13 v31.75,43.02
N$21
  Top 0.432: IC3.8 30.82,39.39 33.02,41.59 R11.1
N$22  (via drill 0.35)
  Top 0.762: TERMISTOR.1 v73.99,25.73 v73.98,25.72
  Top 1.27: R11.2 37.15,40.64 v36.2,39.69
  Bottom 0.762: v73.98,25.72 69.22,20.95 35.72,20.95 27.78,28.89 27.78,32.54 34.92,39.69 v36.2,39.69
N$23
  Top 0.432: D4.1 28.14,45.09 28.78,44.45 C6.2 28.22,43.77 IC3.12 28.22,40.04 23.82,44.44 D5.1
  Top 2.159: D5.1 20.32,47.62 20.32,53.46 L3.1
N$24
  Top 0.432: IC3.7 34.61,38.42 R16.1
N$25
  Top 1.27: R14.1 R16.2 39.05,39.69 39.05,43.5 38.1,44.45 R13.2
N$26
  Top 0.432: IC3.11 28.87,41.89 30.8,43.81 C6.1
N$27
  Top 0.432: IC3.3 29.53,32.38 29.84,32.07 29.84,31.43 28.89,30.48 C5.1 27.94,31.12 27.94,33.7 IC3.1 26.01,36.2 23.18,36.2 21.59,37.78 IC4.4
  Top 1.27: C5.1 R17.1 28.58,27.62 24.29,23.33 D3.1
N$28  (via drill 0.35)
  Top 0.432: IC3.2 28.87,31.77 v28.89,31.75 | v32.38,26.35 31.11,25.08 R18.1 | v32.38,26.35 31.11,27.62 R17.2 | v32.38,26.35 30.8,26.35 | v23.5,32.07 22.86,32.7 IC4.6
  Top 0.61: IC4.6 22.86,34.61 20.32,37.15 20.32,40.01 21.91,41.59 R20.1
  Top 1.27: R18.1 30.8,26.35 R17.2
  Bottom 0.432: v32.38,26.35 32.7,26.67 32.7,27.94 v28.89,31.75 29.84,31.75 37.47,39.37 37.47,40.32 36.83,40.96 33.97,40.96 25.08,32.07 v23.5,32.07
N$29
  Top 0.61: IC4.1 25.4,40.64 R20.2
N$30
  Top 0.432: D4.2 31.55,51.26 D6.1
OFF/!ON  (via drill 0.35)
  Top 0.813: IC5.1 35.24,23.02 v36.2,22.07 | v54.77,38.58 54.69,38.58 IC1.5 | 71.52,37.55 v70.48,38.58 | IC2.5 71.52,37.55 | 71.52,37.55 71.69,37.37
  Top 1.016: IC2.5 71.69,37.37 74.07,37.37 77.47,33.97 OFF/!ON.2
  Bottom 0.813: v36.2,22.07 37.31,22.07 53.82,38.58 v54.77,38.58 v70.48,38.58
PV
  Top 0.33: IC6.10 70.49,67.57 69.53,68.53 69.53,70.8 R27.1
SCL1  (via drill 0.35)
  Top 0.33: SCL.1 79.82,67.5 79.06,68.26 77.47,68.26 74.93,65.72 v74.93,65.09 74.29,64.44 IC6.6 | R7.1 41.63,73.31 PILHA.19
  Bottom 0.33: v74.93,65.09 74.93,65.41 73.98,66.36 73.03,66.36 69.53,62.87 65.09,62.87 53.66,74.3 43.16,74.3 PILHA.19
SDA1  (via drill 0.35)
  Top 0.33: SDA.1 80.96,65.6 80.96,67.94 80.01,68.9 77.15,68.9 v73.66,65.41 73.35,65.09 IC6.7 | R8.1 37.15,72.71 39.09,74.65 PILHA.17
  Bottom 0.33: v73.66,65.41 70.17,61.91 64.77,61.91 53.02,73.66 41.26,73.66 PILHA.17
SOL+  (via drill 0.35)
  Top 1.27: v20.48,32.07 22.22,30.33 D3.2 v23.5,28.57
  Bottom 1.27: v20.48,32.07 20.48,34.45 26.39,40.36 PILHA.7 | U$1.P$1 14.29,19.37 v23.5,28.57
SOL-
  Bottom 1.27: U$1.P$2 14.92,24.41 14.92,77.79 17.78,80.64 24.77,80.64 26.39,79.02 PILHA.8
TC  (via drill 0.35)
  Top 0.33: IC6.13 68.24,65.75 v67.31,66.67 | R26.1 v66.04,68.26
  Bottom 0.33: v67.31,66.67 66.04,67.94 v66.04,68.26
VPU  (via drill 0.35)
  Top 0.33: IC6.16 68.3,63.82 v66.04,63.82 | v64.77,71.12 R27.2
  Bottom 0.33: v64.77,71.12 64.77,65.09 v66.04,63.82
WARNING
  Top 0.33: R24.1 74.61,70.8 74.61,68.26 72.09,65.75 IC6.8

### Text on the board
tNames: GND | GND | BAT | 5V | 3V3 | 5V GND 3V3 | FONTE